# Altium schematic sheet Power.SchDoc
size A4; Organization: Altium Limited; Address1: L3, 12a Rodborough Rd; Address2: Frenchs Forest; Address3: NSW; Address4: Australia 2086; SheetNumber: 2; SheetTotal: 8
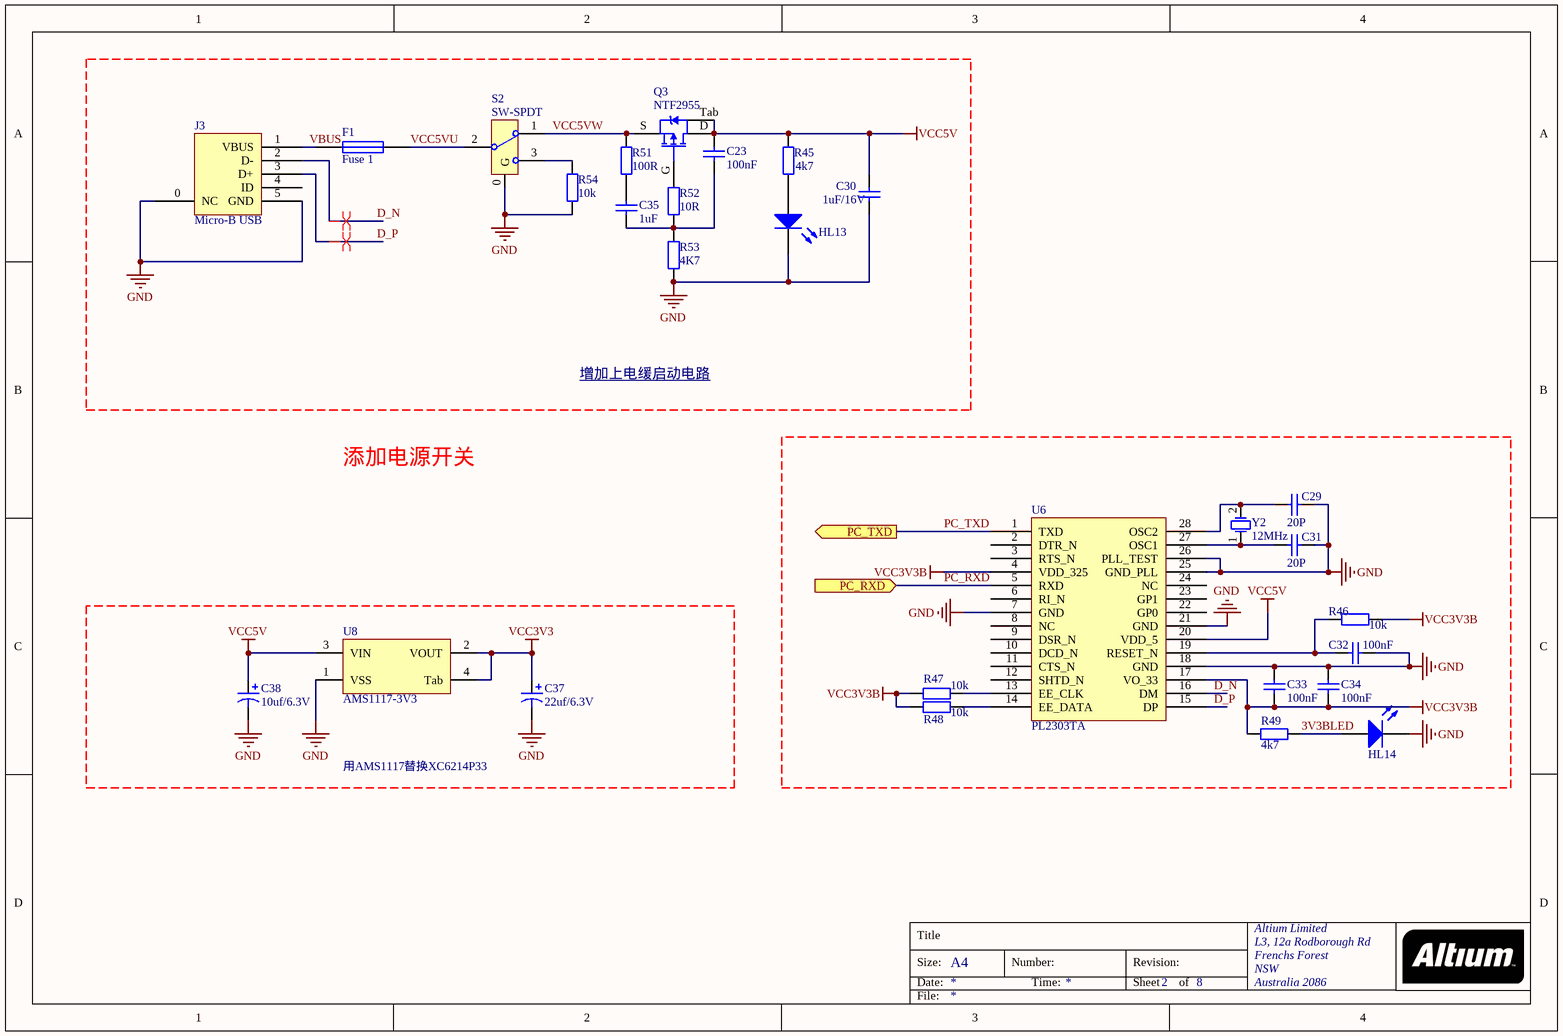
[diagram p0: Power.SchDoc]

## Parts
C23  100nF  [C0603]
C29  20P  [R0603]
C30  1uF/16V  [C0805]
C31  20P  [R0603]
C32  100nF  [R0603]
C33  100nF  [R0603]
C34  100nF  [C0805]
C35  1uF  [C0603]
C37  22uf/6.3V  [B-3528]
C38  10uf/6.3V  [B-3528]
F1  Fuse 1  [R0805]
HL13  LED  [LED_0603]  (value not drawn)
HL14  LED  [LED_0603]  (value not drawn)
J3  Micro-B USB  [Micro-B  USB1]
Q3  NTF2955  [NTF2955]
R45  4k7  [R0603]
R46  10k  [R0603]
R47  10k  [R0603]
R48  10k  [R0603]
R49  4k7  [R0603]
R51  100R  [R0603]
R52  10R  [R0603]
R53  4K7  [R0603]
R54  10k  [R0603]
S2  SW-SPDT  [SW_SPDT]
U6  PL2303TA  [SSOP28]
U8  AMS1117-3V3  [SOT-223]
Y2  12MHz  [XTAL]

## Ports
PC_RXD (in), PC_TXD (out)

## Nets
GND: C29.2 C30.1 C31.2 C32.1 C33.1 C34.1 C37.2 C38.2 HL13.K HL14.K J3.0(NC) J3.5(GND) R53.1 R54.1 S2.0(G) U6.7(GND) U6.18(GND) U6.21(GND) U6.25(GND_PLL) U6.26(PLL_TEST) U8.1(VSS)
VCC3V3: C37.1 U8.2(VOUT) U8.4(Tab)
VCC3V3B: C33.2 C34.2 R46.2 R47.1 R48.1 R49.1 U6.4(VDD_325) U6.17(VO_33)
VCC5V: C23.2 C30.2 C38.1 Q3.D Q3.Tab(D) R45.2 U6.20(VDD_5) U8.3(VIN)
3V3BLED: HL14.A R49.2
D_N: J3.2(D-) U6.16(DM)
D_P: J3.3(D+) U6.15(DP)
PC_RXD: U6.5(RXD) ; port PC_RXD
PC_TXD: U6.1(TXD) ; port PC_TXD
VBUS: F1.1 J3.1(VBUS)
VCC5VU: F1.2 S2.2(COMMON)
VCC5VW: Q3.S R51.2 S2.1(NO1)
NetC23_1: C23.1 C35.2 R52.1 R53.2
NetC29_1: C29.1 U6.28(OSC2) Y2.2(OSC2)
NetC31_1: C31.1 U6.27(OSC1) Y2.1(OSC1)
NetC32_2: C32.2 R46.1 U6.19(RESET_N)
NetC35_1: C35.1 R51.1
NetHL13_A: HL13.A R45.1
NetQ3_G: Q3.G R52.2
NetR47_2: R47.2 U6.13(EE_CLK)
NetR48_2: R48.2 U6.14(EE_DATA)
NetR54_2: R54.2 S2.3(NO3)

Not connected (* = marked no-connect by the designer): J3 4(ID); U6 2(DTR_N) 3(RTS_N) 6(RI_N) 8(NC) 9(DSR_N) 10(DCD_N) 11(CTS_N) 12(SHTD_N) 22(GP0) 23(GP1) 24(NC)

## Layout directives
differential pair: D_N, D_P

## Notes on the sheet
- 增加上电缓启动电路
- 添加电源开关
- 用AMS1117替换XC6214P33
- Title
- Size:
- Date:
- A4
- Number:
- Time:
- Revision:
- Sheet
- of
- File:

## Library data of the parts
C23 C30 C35 = CAP_08
C29 C31-C34 = CAP_06
C37 C38 = CAP_B
F1 = Fuse 1: Fuse; Published: 8-Jun-2000; LatestRevisionDate: 17-Jul-2002; LatestRevisionNote: Re-released for DXP Platform.; PackageReference: PIN-W2/E2.8; Publisher: Altium Limited; PackageDescription: Thru-Hole; 2 Leads
HL13 HL14 = LED 2
Q3 = NTF2955-3
R45-R49 R51-R54 = RES_06
S2 = SW-SPDT: Single-Pole, Duble Throw Switch; Published: 24-Mar-1999; LatestRevisionDate: 17-Jul-2002; LatestRevisionNote: Re-released for DXP Platform.; PackageReference: SPST-2; Publisher: Altium Limited; PackageDescription: Switch; 2 Leads
U8 = AMS1117
Y2 = XTAL: Passive crystal